# EasyEDA Pro project  2S锂电池充电+均衡板 TP5100+ETA3000方案.eprj

# Schematic TP5100验证板18650锂电池充电器
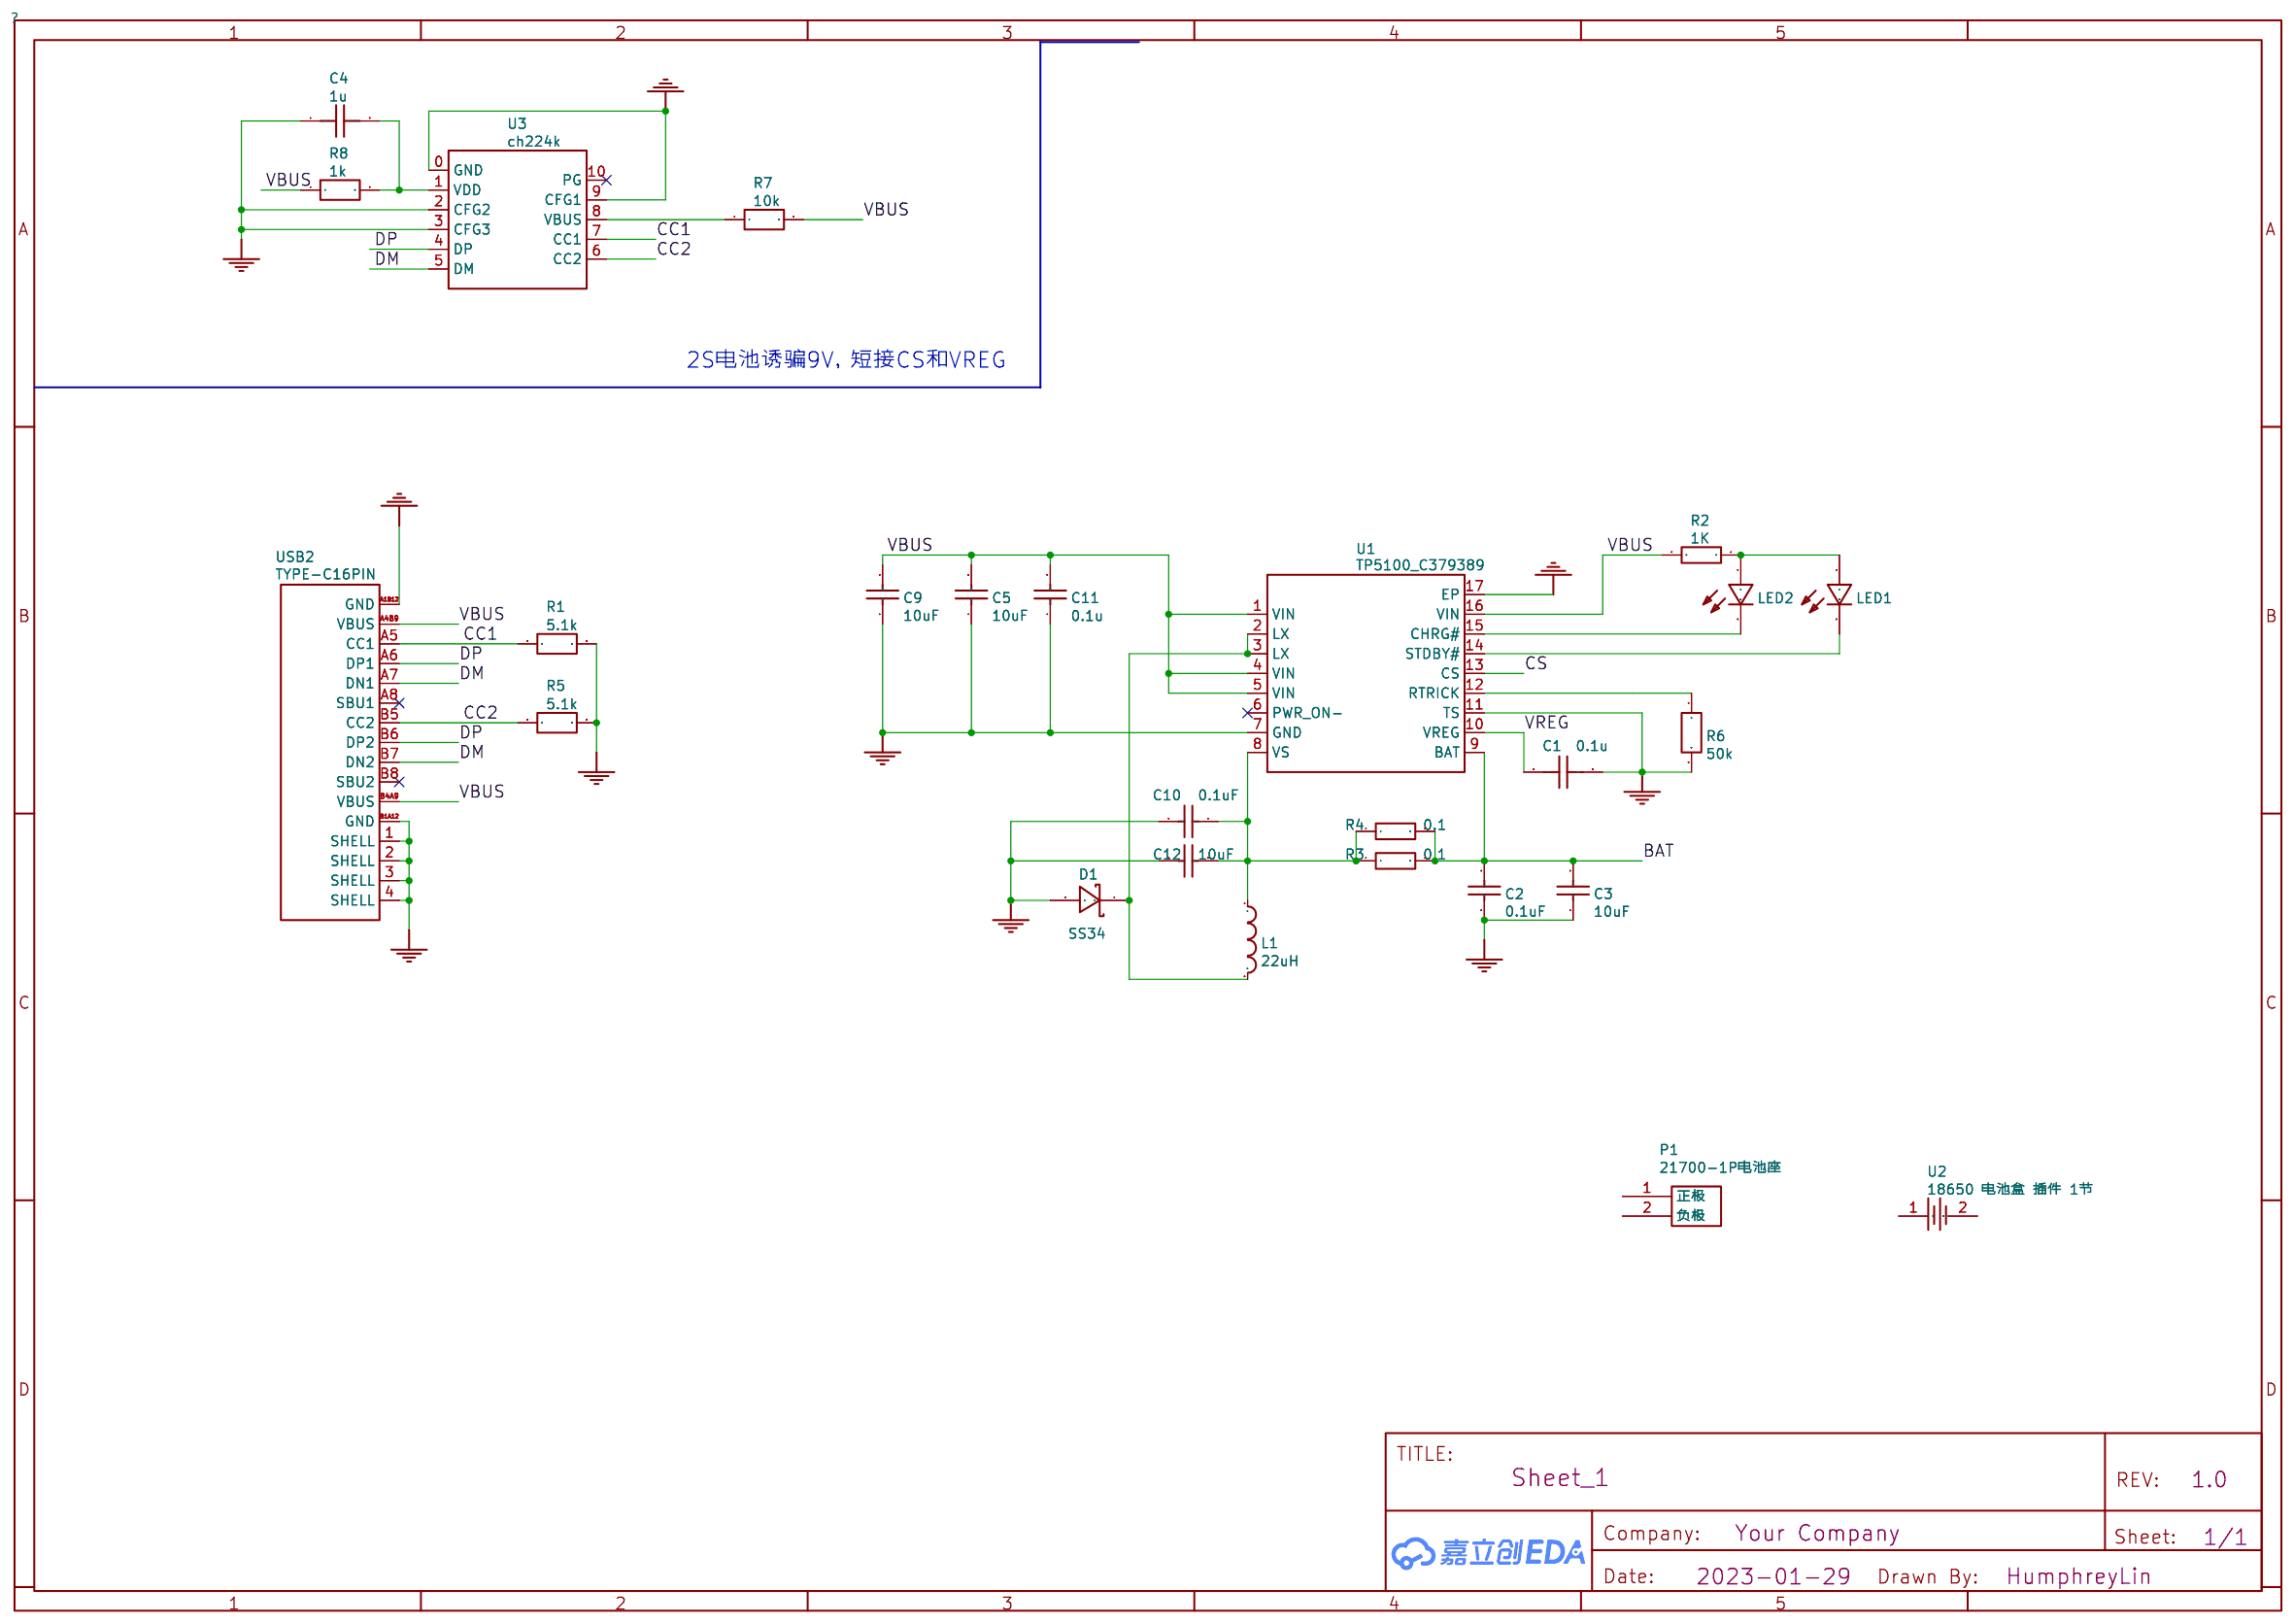
[diagram p0: schematic sheet]

## Parts
C1  0.1u  [C0603]
C2  0.1uF  [C0603]
C3  10uF  [C1206]
C4  1u  [C0603]
C5  10uF  [C1206]
C9  10uF  [C1206]
C10  0.1uF  [C0603]
C11  0.1u  [C0603]
C12  10uF  [C1206]
D1  SS34  [DO-214AC_L4.3-W2.7-LS5.3-RD]
L1  22uH  [IND-SMD_L10.8-W10.0_SLO1040H]
LED1  19-217/BHC-ZL1M2RY/3T  [LED0603-R-RD]
LED2  19-217/BHC-ZL1M2RY/3T  [LED0603-R-RD]
P1  21700-1P电池座
R1  5.1k  [R0603]
R2  1K  [R0603]
R3  0.1  [R1206]
R4  0.1  [R1206]
R5  5.1k  [R0603]
R6  50k  [R0603]
R7  10k  [R0603]
R8  1k  [R0805]
U1  TP5100_C379389  [TQFN-16_L4.0-W4.0-P0.65-BL-EP]
U2  18650 电池盒 插件 1节
U3  ch224k  [CH224K]
USB2  TYPE-C16PIN  [USB-C-SMD_TYPE-C16PIN]

## Library data of the parts
C1 = 0.1u: nameAlias: Value(F); Contributor: LCEDA_Lib; spicePre: C; spiceSymbolName: C_0603_US
C2 C3 C5 C9 C10 C12 = CL31A106KAHNNNE: Supplier: LCSC; Manufacturer: SAMSUNG; Supplier Part: C9807; nameAlias: Capacitance; spicePre: C
C4 = 1u: nameAlias: Value(F); Contributor: LCEDA_Lib; spicePre: C; spiceSymbolName: C_0603_US
C11 = CL10B102KB8NNNC: Supplier: LCSC; Manufacturer: SAMSUNG; Supplier Part: C1588; JLCPCB Part Class: Basic; nameAlias: Capacitance; spicePre: C
D1 = SS34: Supplier: LCSC; Manufacturer: MDD; image: //image.lceda.cn/szlcsc/C8678.jpg; Supplier Part: C8678; JLCPCB Part Class: Basic; spicePre: D; spiceSymbolName: SS34_C8678
L1 = SLO1040H220MTT: Supplier: LCSC; Manufacturer: Sunltech; Supplier Part: C182173; nameAlias: Inductance; Contributor: LCSC; spicePre: L
LED1 LED2 = 19-217/BHC-ZL1M2RY/3T: Supplier: LCSC; Manufacturer: EVERLIGHT; image: //image.lceda.cn/szlcsc/C72041.jpg; Supplier Part: C72041; JLCPCB Part Class: Basic; spicePre: L
P1 = 21700-1P电池座: Contributor: w764516453; spicePre: P
R1 R5 = 5.1k: nameAlias: Value(Ω); Contributor: LCEDA_Lib; spicePre: R; spiceSymbolName: R_0603_EU
R2 = 0603WAF3302T5E: Supplier: LCSC; Manufacturer: UniOhm; Supplier Part: C4216; JLCPCB Part Class: Basic; nameAlias: Resistance (Ohms); spicePre: R
R3 R4 = 1206W4F100LT5E: Supplier: LCSC; Manufacturer: UniOhm; Supplier Part: C25334; JLCPCB Part Class: Basic; nameAlias: Resistance (Ohms); spicePre: R
R6 = 50k: nameAlias: Value(Ω); Contributor: LCEDA_Lib; spicePre: R; spiceSymbolName: R_0603_EU
R7 = 10k: nameAlias: Value(Ω); Contributor: LCEDA_Lib; spicePre: R; spiceSymbolName: R_0603_EU
R8 = 1k: nameAlias: Value(Ω); Contributor: LCEDA_Lib; spicePre: R; spiceSymbolName: R_0805_EU
U1 = TP5100: Supplier: LCSC; Supplier Part: C379389; Manufacturer: Nanjing Extension Microelectronics; JLCPCB Part Class: Extend; Contributor: LCSC; spicePre: U
U2 = 18650 电池盒 插件 1节: Supplier: LCSC; Supplier Part: C9900004923; Manufacturer: null; link: https://atta.szlcsc.comnull; JLCPCB Part Class: Extended Part; Contributor: LCSC; spicePre: U
U3 = CH224DS1: Manufacturer: WCH; link: http://www.wch.cn/downloads/CH224DS1_PDF.html; Contributor: rxyuvty; spicePre: U
USB2 = TYPE-C16PIN: Supplier: LCSC; Supplier Part: C393939; Manufacturer: SHOU HAN; JLCPCB Part Class: Extended Part; Contributor: LCSC; spicePre: U

## Nets
GND: C1.2 C2.1 C3.1 C4.1 C5.1 C9.1 C10.2 C11.1 C12.1 D1.2(A) R1.2 R5.2 R6.2 U1.7(GND) U1.11(TS) U1.17(EP) U3.0(GND) U3.2(CFG2) U3.3(CFG3) U3.9(CFG1) USB2.1(SHELL) USB2.2(SHELL) USB2.3(SHELL) USB2.4(SHELL) USB2.A1B12(GND) USB2.B1A12(GND)
VBUS: C5.2 C9.2 C11.2 R2.2 R7.2 R8.1 U1.1(VIN) U1.4(VIN) U1.5(VIN) U1.16(VIN) USB2.A4B9(VBUS) USB2.B4A9(VBUS)
BAT: C2.2 C3.2 R3.2 R4.2 U1.9(BAT)
CC1: R1.1 U3.7(CC1) USB2.A5(CC1)
CC2: R5.1 U3.6(CC2) USB2.B5(CC2)
CS: U1.13(CS)
DM: U3.5(DM) USB2.A7(DN1) USB2.B7(DN2)
DP: U3.4(DP) USB2.A6(DP1) USB2.B6(DP2)
VREG: C1.1 U1.10(VREG)
C10_1: C10.1 C12.2 L1.1 R3.1 R4.1 U1.8(VS)
D1_1: D1.1(K) L1.2 U1.2(LX) U1.3(LX)
LED2_2: LED2.2(C) U1.15(CHRG#)
R2_1: LED1.1(A) LED2.1(A) R2.1
U1_12: R6.1 U1.12(RTRICK)
U1_14: LED1.2(C) U1.14(STDBY#)
U3_1: C4.2 R8.2 U3.1(VDD)
U3_8: R7.1 U3.8(VBUS)

Not connected (* = marked no-connect by the designer): P1 1(正极) 2(负极); U1 6(PWR_ON-)*; U2 1 2; U3 10(PG)*; USB2 A8(SBU1)* B8(SBU2)*

## Notes on the sheet
- 2S电池诱骗9V，短接CS和VREG

# Board 1-PCB_PCB_TP5100验证板
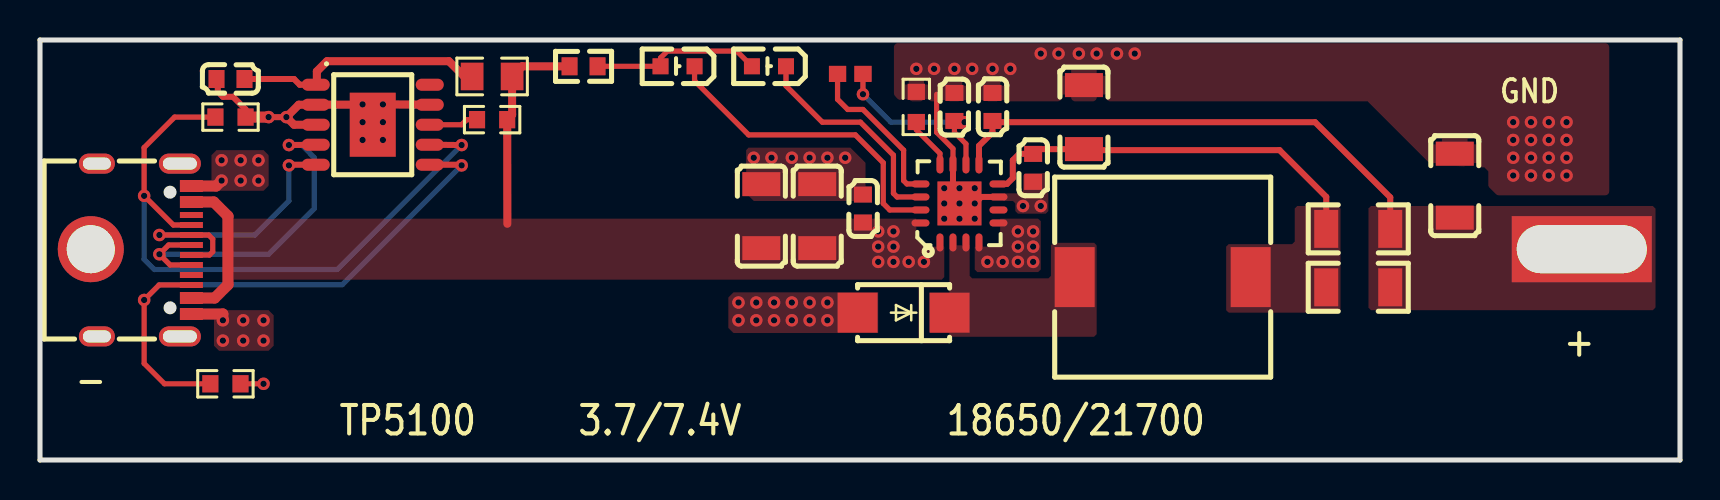
[diagram p1: board, top side]
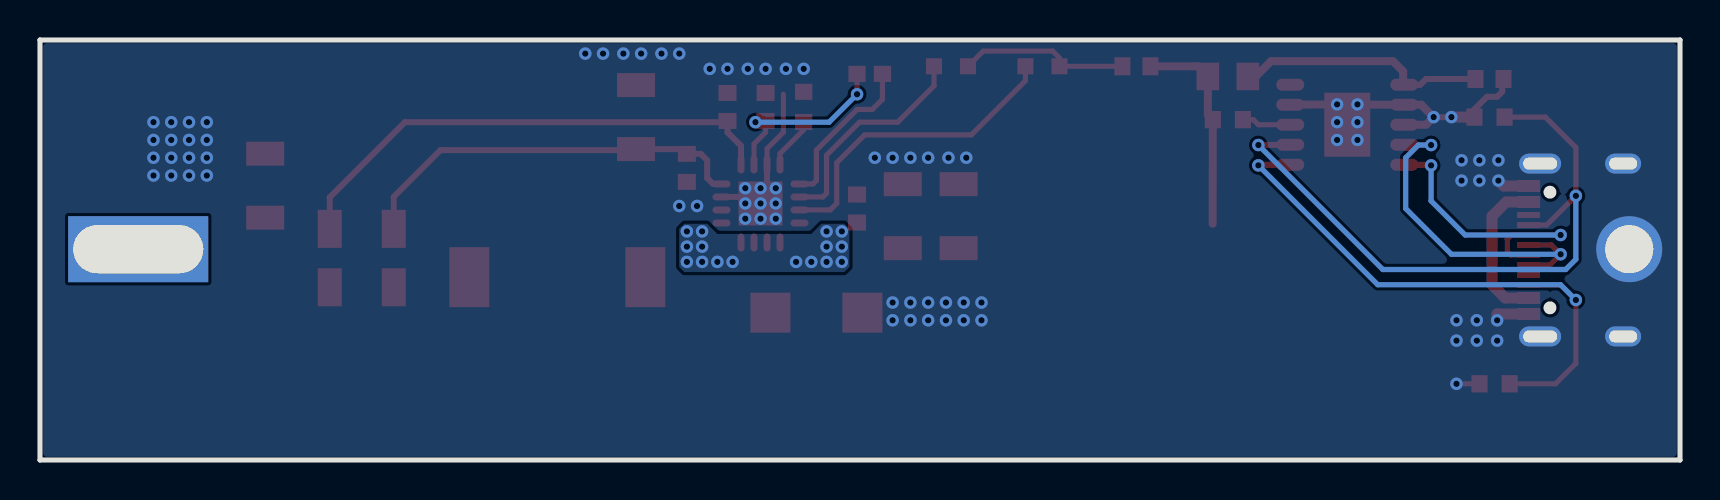
[diagram p2: board, bottom side, seen from below]

Outline 82 x 21 mm; copper layers: Top Layer, Bottom Layer. Coordinates in mm from the lower left corner of the outline.
Outline path: 0,21 82,21 82,0 0,0 0,21

## Design rules (mm)
via Default (default): diameter min 0.61, default 0.61, max 100.025; hole min 0.305, default 0.305, max 59.995
pour e19 uses gge8842846562239585
pour e171 uses gge8842846562239897

## Placement (name value [footprint] x y rotation side)
C1  0.1u  [C0603]  45.72 17.65 90 top
C2  0.1uF  [C0603]  47.62 17.65 270 top
C3  10uF  [C1206]  70.74 13.72 270 top
C4  1u  [C0603]  9.53 19.05 0 top
C5  10uF  [C1206]  36.07 12.19 270 top
C9  10uF  [C1206]  38.86 12.19 270 top
C10  0.1uF  [C0603]  49.66 14.61 270 top
C11  0.1u  [C0603]  41.15 12.57 270 top
C12  10uF  [C1206]  52.2 17.14 270 top
D1  SS34  [DO-214AC_L4.3-W2.7-LS5.3-RD]  43.18 7.37 180 top
L1  22uH  [IND-SMD_L10.8-W10.0_SLO1040H]  56.13 9.14 180 top
LED1  19-217/BHC-ZL1M2RY/3T  [LED0603-R-RD]  36.45 19.69 180 top
LED2  19-217/BHC-ZL1M2RY/3T  [LED0603-R-RD]  31.88 19.69 180 top
NOREF  -  [Pad_e174]  41.15 19.3 90 top
NOREF#2  -  [Pad_e433]  2.54 10.54 0 top
NOREF#3  -  [Pad_e432]  77.09 10.54 0 top
NOREF#4  -  [Pad_e173]  39.88 19.3 90 top
R1  5.1k  [R0603]  9.53 17.14 0 top
R2  1K  [R0603#2]  27.18 19.69 180 top
R3  0.1  [R1206]  65.91 8.64 0 top
R4  0.1  [R1206]  65.91 11.56 0 top
R5  5.1k  [R0603]  9.27 3.81 0 top
R6  50k  [R0603]  43.81 17.65 90 top
R7  10k  [R0603]  22.61 17.02 0 top
R8  1k  [R0805]  22.61 19.18 180 top
U1  TP5100_C379389  [TQFN-16_L4.0-W4.0-P0.65-BL-EP]  45.97 12.83 0 top
U3  ch224k  [CH224K]  16.64 16.76 0 top
USB2  TYPE-C16PIN  [USB-C-SMD_TYPE-C16PIN]  5.21 10.5 270 top

## Footprints (pads in the part's own frame, mm; a bottom-side part is the same pattern mirrored in y, then rotated)
C0603
  rect 0.8x0.9 smd: 1(-0.7,0) 2(0.7,0)
C1206
  rect 1.2x1.9 smd: 1(-1.6,0) 2(1.6,0)
CH224K
  rect 2.3x3.2 smd: 0(0,0)
  oval 1.4x0.6 smd: 1(-2.85,2) 2(-2.85,1) 3(-2.85,0) 4(-2.85,-1) 5(-2.85,-2) 6(2.85,-2) 7(2.85,-1) 8(2.85,0) 9(2.85,1) 10(2.85,2)
DO-214AC_L4.3-W2.7-LS5.3-RD
  rect 2x2 smd: 1(-2.3,0) 2(2.3,0)
IND-SMD_L10.8-W10.0_SLO1040H
  rect 2x3 smd: 1(-4.4,0) 2(4.4,0)
LED0603-R-RD
  rect 0.8x0.8 smd: 1(0.851,0) 2(-0.851,0)
Pad_e173
  rect 0.806x0.864 smd: 2(0,0)
Pad_e174
  rect 0.806x0.864 smd: 2(0,0)
Pad_e432
  rect 7x3.3 hole 6.5x2.4: 1(0,0)
Pad_e433
  round 3.3 hole 2.4: 2(0,0)
R0603
  rect 0.806x0.864 smd: 1(-0.753,0) 2(0.753,0)
R0603#2
  rect 0.8x0.9 smd: 1(-0.7,0) 2(0.7,0)
R0805
  rect 1.133x1.377 smd: 1(-1,0) 2(1,0)
R1206
  rect 1.2x1.9 smd: 1(-1.6,0) 2(1.6,0)
TQFN-16_L4.0-W4.0-P0.65-BL-EP
  oval 0.35x0.9 smd: 1(-0.975,-1.95) 2(-0.325,-1.95) 3(0.325,-1.95) 4(0.975,-1.95) 9(0.975,1.95) 10(0.325,1.95) 11(-0.325,1.95) 12(-0.975,1.95)
  oval 0.9x0.35 smd: 5(1.95,-0.975) 6(1.95,-0.325) 7(1.95,0.325) 8(1.95,0.975) 13(-1.95,0.975) 14(-1.95,0.325) 15(-1.95,-0.325) 16(-1.95,-0.975)
  rect 2.2x2.2 smd: 17(0,0.001)
USB-C-SMD_TYPE-C16PIN
  oval 1x2.1 hole 0.6x1.7: 1(-4.32,1.788) 2(4.32,1.788)
  oval 1x1.8 hole 0.6x1.4: 3(-4.32,-2.362) 4(4.32,-2.362)
  rect 0.6x1.15 smd: A1B12(-3.2,2.362) A4B9(-2.4,2.362) B1A12(3.2,2.362) B4A9(2.4,2.362)
  rect 0.3x1.15 smd: A5(-1.25,2.362) A6(-0.25,2.362) A7(0.25,2.362) A8(-1.75,2.362) B5(1.75,2.362) B6(0.75,2.362) B7(-0.75,2.362) B8(1.25,2.362)

## Nets
GND: C1.2 C2.1 C3.1 C4.1 C5.1 C9.1 C10.2 C11.1 C12.1 D1.2 NOREF#2.2 R1.2 R5.2 R6.2 U1.7 U1.11 U1.17 U3.0 U3.2 U3.3 U3.9 USB2.1 USB2.2 USB2.3 USB2.4 USB2.A1B12 USB2.B1A12
VBUS: C5.2 C9.2 C11.2 R2.2 R7.2 R8.1 U1.1 U1.4 U1.5 U1.16 USB2.A4B9 USB2.B4A9
BAT: C2.2 C3.2 NOREF#3.1 R3.2 R4.2 U1.9
C10_1: C10.1 C12.2 L1.1 R3.1 R4.1 U1.8
CC1: R1.1 U3.7 USB2.A5
CC2: R5.1 U3.6 USB2.B5
CS: NOREF#4.2 U1.13
D1_1: D1.1 L1.2 U1.2 U1.3
DM: U3.5 USB2.A7 USB2.B7
DP: U3.4 USB2.A6 USB2.B6
LED2_2: LED2.2 U1.15
R2_1: LED1.1 LED2.1 R2.1
U1_12: R6.1 U1.12
U1_14: LED1.2 U1.14
U3_1: C4.2 R8.2 U3.1
U3_8: R7.1 U3.8
VREG: C1.1 NOREF.2 U1.10

Pads without a net: U1 6; U3 10; USB2 A8 B8

## Via types
v1: diameter 0.625, hole 0.32, Top Layer to Bottom Layer, 104 vias

## Routing (per net, layer and track width the routed paths; a pad name or vN(x,y) marks a point on that pad's centre or on a via; arc(x,y) is an arc through that point)
GND: length 25.3
  Top Layer w0.254: 45.65,14.78 45.65,15.56 44.83,16.38 44.83,18.29 ; R5.2 v1(11.18,3.81)
  Top Layer w0.3: U1.7 47.06,13.15 v1(46.74,12.83) ; C4.1 8.89,18.98 8.89,18.42 9.14,18.16 9.65,18.16 10.28,17.53 R1.2 ; 45.65,14.78 45.65,13.26 ; v1(11.43,17.14) v1(12.32,17.14)
  Top Layer w0.4: U3.3 12.7,16.76 v1(12.32,17.14) 12.94,17.76 U3.2 15.89,17.77 16.64,17.02 U3.0 ; U3.9 v1(17.14,17.78)
  Top Layer w0.55: v1(9.14,6.98) 9.14,7.3 USB2.B1A12 ; R1.2 v1(11.43,17.14) ; v1(9.08,13.97) 8.81,13.7 USB2.A1B12
  vias: v1(9.08,14.99) v1(9.14,5.97) v1(10.03,14.99) v1(10.03,13.97) v1(10.16,6.98) v1(10.16,5.97) v1(10.92,14.99) v1(10.92,13.97) v1(11.18,6.98) v1(11.18,5.97) v1(16.13,17.78) v1(16.13,16.89) v1(16.13,16) v1(17.14,16.89) v1(17.14,16) v1(34.93,7.87) v1(34.93,6.98) v1(35.69,15.11) v1(35.81,7.87) v1(35.81,6.98) v1(36.58,15.11) v1(36.7,7.87) v1(36.7,6.98) v1(37.59,15.11) v1(37.59,7.87) v1(37.59,6.98) v1(38.48,15.11) v1(38.48,7.87) v1(38.48,6.98) v1(39.37,15.11) v1(39.37,7.87) v1(39.37,6.98) v1(40.26,15.11) v1(43.81,19.56) v1(44.7,19.56) v1(45.21,13.59) v1(45.21,12.83) v1(45.21,12.06) v1(45.72,19.56) v1(45.97,13.59) v1(45.97,12.83) v1(45.97,12.06) v1(46.61,19.56) v1(46.74,13.59) v1(46.74,12.06) v1(47.62,19.56) v1(48.51,19.56) v1(49.15,12.7) v1(50.04,20.32) v1(50.04,12.7) v1(50.93,20.32) v1(51.94,20.32) v1(52.83,20.32) v1(53.85,20.32) v1(54.74,20.32) v1(73.66,16.89) v1(73.66,16) v1(73.66,15.11) v1(73.66,14.22) v1(74.55,16.89) v1(74.55,16) v1(74.55,15.11) v1(74.55,14.22) v1(75.44,16.89) v1(75.44,16) v1(75.44,15.11) v1(75.44,14.22) v1(76.33,16.89) v1(76.33,16) v1(76.33,15.11) v1(76.33,14.22)
VBUS: length 18.2
  Top Layer w0.4: 23.37,11.81 R7.2 23.61,17.26 R8.1 24.11,19.69 R2.2
  Top Layer w0.55: 7.57,8.1 8.73,8.1 9.4,8.76 9.4,12.19 8.69,12.9 7.57,12.9
  vias: v1(41.91,11.43) v1(41.91,10.67) v1(41.91,9.91) v1(42.67,11.43) v1(42.67,10.67) v1(42.67,9.91) v1(43.43,9.91) v1(44.2,9.91) v1(47.37,9.91) v1(48.13,9.91) v1(48.9,11.43) v1(48.9,10.67) v1(48.9,9.91) v1(49.66,11.43) v1(49.66,10.67) v1(49.66,9.91)
BAT: length 25.5
  Top Layer w0.3: 46.95,14.78 46.95,15.71 47.62,16.38 C2.2 47.69,16.89 63.75,16.89 67.51,13.13 R4.2
C10_1: length 20.2
  Top Layer w0.3: C10.1 49.9,15.55 C12.2 52.25,15.49 61.98,15.49 64.31,13.16 64.31,11.56 ; U1.8 48.35,13.8 48.64,14.1 48.64,14.99 48.96,15.31 49.66,15.31
CC1: length 33
  Top Layer w0.26: 7.57,11.75 6.67,11.75 v1(5.21,13.21) 5.21,15.62 6.73,17.14 8.77,17.14
  Top Layer w0.3: U3.7 v1(21.08,15.75)
  Bottom Layer w0.26: v1(21.08,15.75) 14.86,9.53 5.72,9.53 5.21,10.03 v1(5.21,13.21)
CC2: length 29.8
  Top Layer w0.254: 7.57,8.75 5.96,8.75 v1(5.21,8) 5.21,4.83 6.22,3.81 8.52,3.81
  Top Layer w0.3: v1(21.08,14.73) 21.05,14.76 U3.6
  Bottom Layer w0.26: v1(5.21,8) 5.97,8.76 15.11,8.76 v1(21.08,14.73)
CS: length 8.1
  Top Layer w0.26: U1.13 43.35,13.8 43.18,13.97 43.18,15.49 41.15,17.53 40.39,17.53 39.88,18.03 NOREF#4.2
DM: length 14.8
  Top Layer w0.26: 7.57,11.25 8.44,11.25 8.64,11.05 8.64,10.41 8.47,10.25 7.57,10.25 ; USB2.B7 v1(5.97,11.25)
  Top Layer w0.3: U3.5 12.48,14.76 v1(12.45,14.73)
  Bottom Layer w0.26: v1(12.45,14.73) 12.45,12.95 10.74,11.25 v1(5.97,11.25)
DP: length 17.7
  Top Layer w0.26: USB2.B6 6.51,9.75 v1(5.97,10.29) 6.43,10.75 USB2.A6
  Top Layer w0.3: v1(12.45,15.75) U3.4
  Bottom Layer w0.26: v1(12.45,15.75) 13.08,15.75 13.72,15.11 13.72,12.57 11.43,10.29 v1(5.97,10.29)
LED2_2: length 15.9
  Top Layer w0.26: LED2.2 32.73,18.96 35.43,16.26 40.77,16.26 42.16,14.86 42.16,12.83 42.49,12.5 U1.15
R2_1: length 8.6
  Top Layer w0.254: LED1.1 34.84,20.45 31.37,20.45 31.03,20.1 LED2.1 R2.1
U1_12: length 2.6
  Top Layer w0.254: 45,14.78 45,15.33 43.81,16.51 43.81,16.9
U1_14: length 11.1
  Top Layer w0.26: LED1.2 37.3,18.71 39.12,16.89 41.02,16.89 42.67,15.24 42.67,13.33 42.85,13.15 U1.14
U3_1: length 12.7
  Top Layer w0.3: C4.2 12.7,19.05 12.99,18.76 U3.1
  Top Layer w0.4: R8.2 21.21,19.18 20.45,19.94 14.35,19.94 13.84,19.43 13.84,18.82 U3.1
U3_8: length 2.5
  Top Layer w0.26: U3.8 21.08,16.76 21.34,17.02 R7.1
VREG: length 9.1
  Top Layer w0.254: 46.3,14.78 46.3,15.8 45.72,16.38 C1.1
  Top Layer w0.26: NOREF.2 v1(41.15,18.29)
  Bottom Layer w0.26: v1(46.23,16.89) 42.54,16.89 v1(41.15,18.29)

## Copper pours and planes (outline as drawn; the poured copper is in the pictures)
GND on Top Layer: 78.36,13.33 72.9,13.33 72.52,13.72 72.52,14.48 72.26,14.73 69.6,14.86 66.42,18.03 43.05,18.03 42.8,18.29 42.8,21.84 43.05,22.1 78.36,22.1
GND on Top Layer: 73.28,17.34 76.84,17.34 76.84,13.65 73.28,13.65
GND on Top Layer: 48.13,14.35 50.42,14.35 50.42,12.32 48.13,12.32
GND on Top Layer: 34.42,8.38 41.91,8.38 41.91,6.35 34.42,6.35
GND on Top Layer: 8.7,7.49 11.68,7.49 11.68,5.46 8.7,5.46
GND on Top Layer: 8.57,15.49 11.43,15.49 11.43,13.46 8.57,13.46
GND on Top Layer: 35.31,15.62 41.28,15.62 41.28,12.95 35.31,12.95
GND on Bottom Layer: 0,21.84 -0.89,21.34 -1.02,20.7 -1.02,-0.38 0,-1.4 77.85,-1.4 83.31,-0.64 83.57,22.1
VBUS on Top Layer: 46.74,12.06 50.04,12.06 50.04,9.4 46.74,9.4
VBUS on Top Layer: 9.14,12.06 33.53,12.06 33.53,9.02 9.14,9.02
VBUS on Top Layer: 33.4,12.06 45.21,12.06 45.21,9.02 33.4,9.02
VBUS on Bottom Layer: 41.53,11.81 50.04,11.81 50.04,9.4 41.53,9.4
BAT on Top Layer: 66.42,12.7 80.77,12.7 80.77,7.49 66.42,7.49
C10_1 on Top Layer: 59.31,12.7 65.02,12.7 65.02,7.37 59.31,7.37
D1_1 on Top Layer: 45.47,10.86 52.83,10.86 52.83,6.16 45.47,6.16

## Text on the board
Top Silkscreen Layer: GND | - | TP5100 | 3.7/7.4V | 18650/21700 | +
